# EAGLE design l293d (EAGLE 7.2.0)
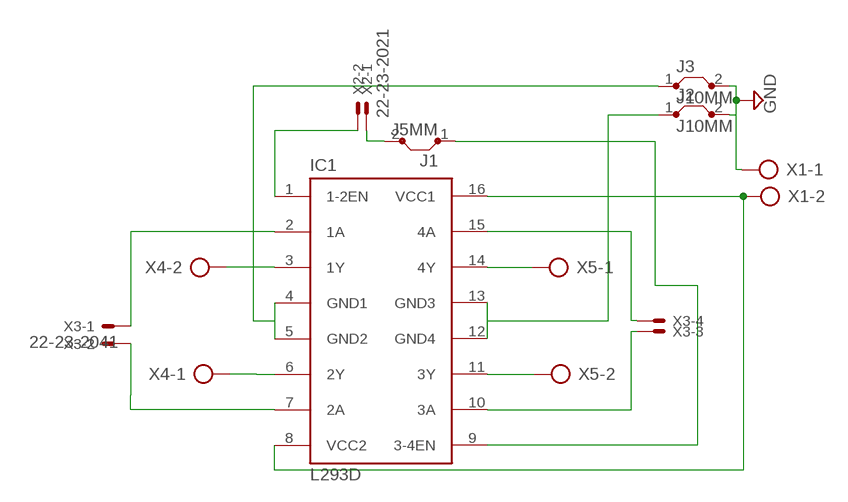
[diagram p0: schematic, sheet 1]

## Parts
IC1  L293D  [DIL16]
J1  J5MM  [05]
J2  J10MM  [10]
J3  J10MM  [10]
X1  AK500/2  [AK500/2]
X2  22-23-2021  [22-23-2021]
X3  22-23-2041  [22-23-2041]
X4  AK500/2  [AK500/2]
X5  AK500/2  [AK500/2]

## Nets
GND: J2.2 J3.2 X1.1
N$1: IC1.10(3A) X3.3
N$2: IC1.8(VCC2) IC1.16(VCC1) X1.2
N$3: IC1.2(1A) X3.1
N$4: IC1.14(4Y) X5.1
N$5: IC1.12(GND4) IC1.13(GND3) J2.1
N$6: IC1.15(4A) X3.4
N$7: IC1.1(1-2EN) X2.2
N$8: IC1.9(3-4EN) J1.1
N$9: IC1.3(1Y) X4.2
N$10: IC1.6(2Y) X4.1
N$11: IC1.11(3Y) X5.2
N$12: IC1.4(GND1) IC1.5(GND2) J3.1
N$15: J1.2 X2.1
N$16: IC1.7(2A) X3.2

## Library data of the parts
IC1 = st-microelectronics:L293D: PUSH-PULL 4 CHANNEL DRIVER; MPN: L293D; OC_FARNELL: 9589619; OC_NEWARK: 56P8249
J1-J3 = jumper:J: Bridge
X1 X4 X5 = con-ptr500:AK500/2: CONNECTOR; OC_FARNELL: unknown; OC_NEWARK: unknown
X2 = con-molex:22-23-2021: .100" (2.54mm) Center Header - 2 Pin; MF: MOLEX; MPN: 22-23-2021; OC_FARNELL: 1462926; OC_NEWARK: 25C3832
X3 = con-molex:22-23-2041: .100" (2.54mm) Center Header - 4 Pin; MF: MOLEX; MPN: 22-23-2041; OC_FARNELL: 1462920; OC_NEWARK: 38C0355

## Board
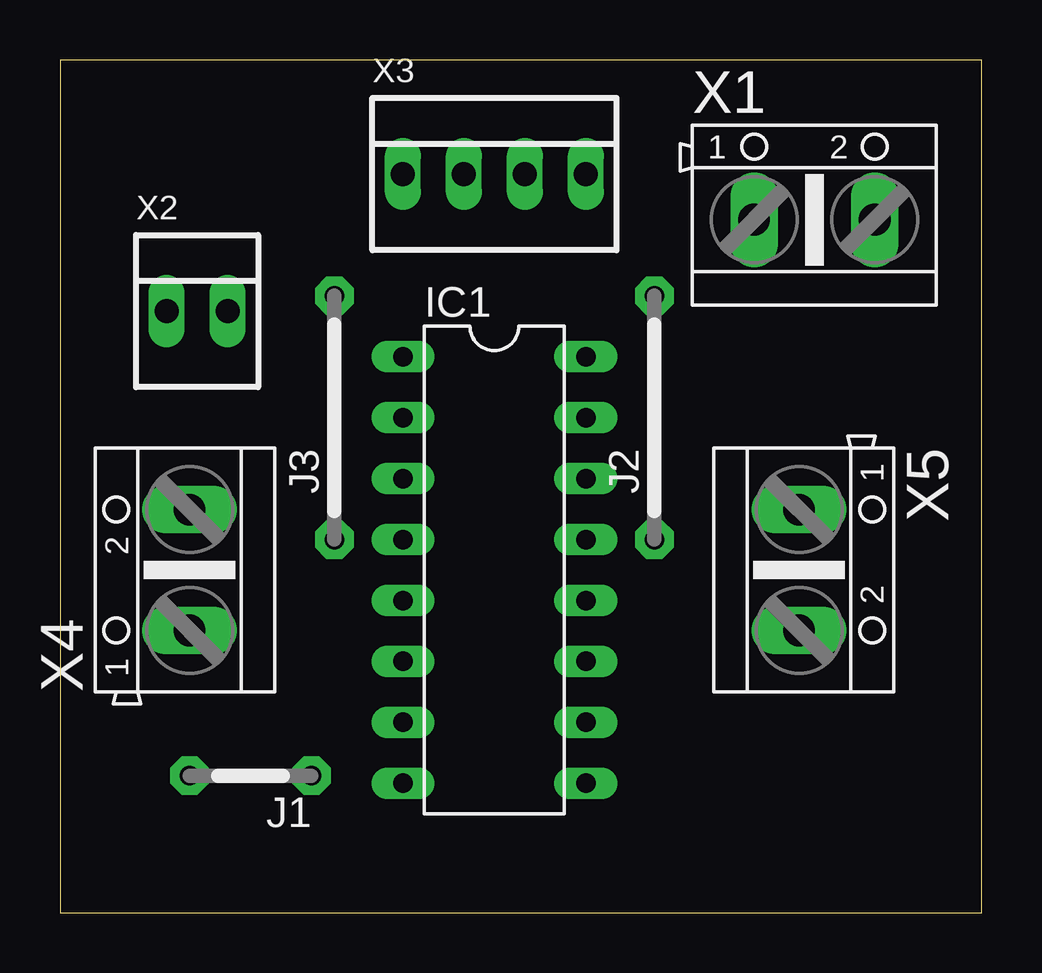
[diagram p1: board, top side]
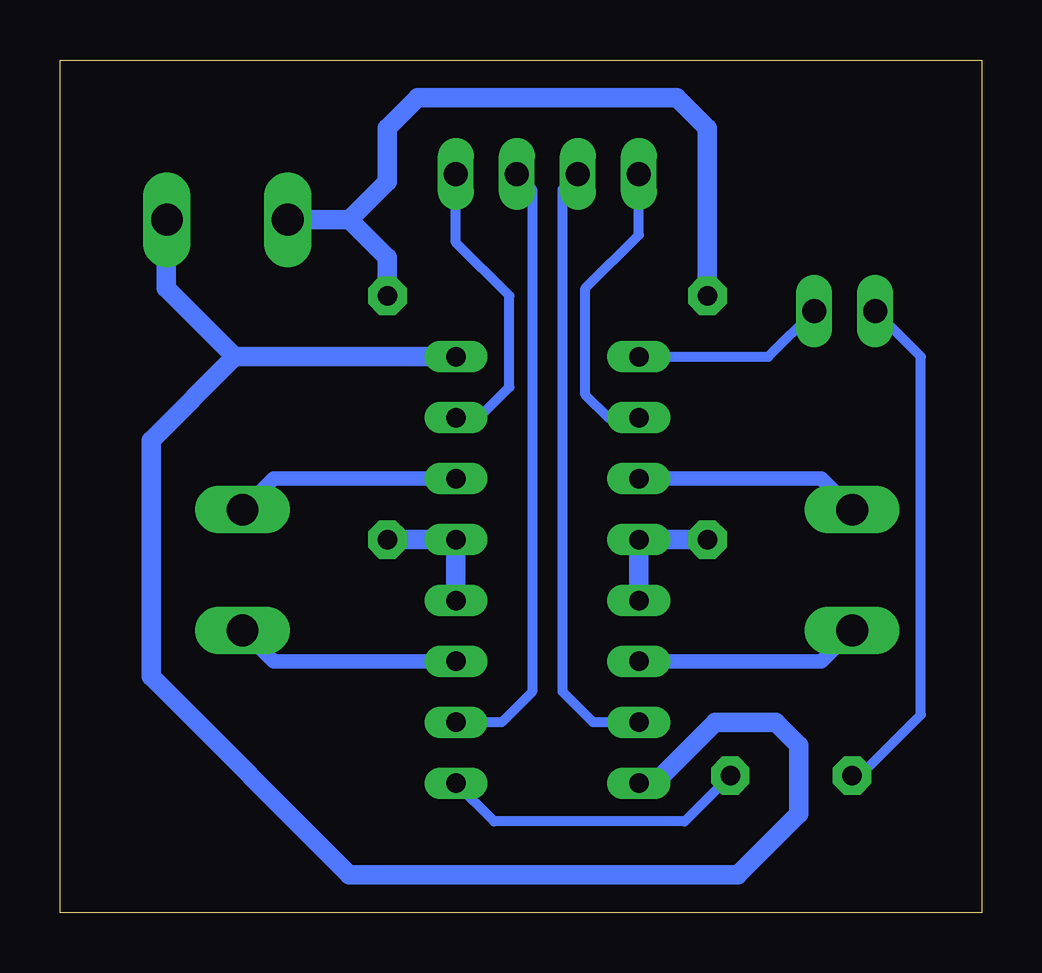
[diagram p2: board, bottom side, seen from below]

Size 38.41 x 35.55 mm. Coordinates in mm from the lower left corner, seen from the top.
Outline: 0,0 38.41,0 38.41,35.55 0,35.55 0,0
Copper layers (1*16): Top 0.035mm / dielectric 1.5mm / Bottom 0.035mm
Design rules "default": minimum track width 10mil, minimum drill 24mil, track to track 8mil, track to pad 8mil, pad to pad 8mil, via to via 8mil, smd to smd 8mil, copper to edge 40mil, drill to drill 8mil, minimum pad ring 10mil, minimum via ring 8mil, stop-mask expansion 4mil, vias tented up to drill 0mil, thermal gap 10mil

### Footprints (pad centres in the part's own frame; a part is rotated, then mirrored left to right if it is on the bottom)
DIL16 = drill 0.813 long: 1 -8.89,-3.81; 2 -6.35,-3.81; 3 -3.81,-3.81; 4 -1.27,-3.81; 5 1.27,-3.81; 6 3.81,-3.81; 7 6.35,-3.81; 8 8.89,-3.81; 9 8.89,3.81; 10 6.35,3.81; 11 3.81,3.81; 12 1.27,3.81; 13 -1.27,3.81; 14 -3.81,3.81; 15 -6.35,3.81; 16 -8.89,3.81
05 = drill 0.813 pad 1.6 octagon: 1 -2.54,0; 2 2.54,0
10 = drill 0.813 pad 1.6 octagon: 1 -5.08,0; 2 5.08,0
AK500/2 = drill 1.321 long: 1 -2.515,0; 2 2.515,0
22-23-2021 = drill 1 long: 1 -1.27,0; 2 1.27,0
22-23-2041 = drill 1 long: 1 -3.81,0; 2 -1.27,0; 3 1.27,0; 4 3.81,0

### Placement (x,y rotation side)
IC1  18.1,14.29 270 top
J1  7.94,5.71 180 top
J2  24.77,20.64 90 top
J3  11.43,20.64 90 top
X1  31.43,28.89 0 top
X2  5.71,25.08 0 top
X3  18.1,30.8 0 top
X4  5.4,14.29 90 top
X5  30.8,14.29 270 top

### Tracks (layer width: path | path; a pad name or v marks a point on that pad's centre or on a via)
GND
  Bottom 0.813: J2.2 24.77,27.3 26.35,28.89 | 26.35,28.89 X1.1 | 26.35,28.89 24.77,30.48 24.77,32.7 23.5,33.97 12.7,33.97 11.43,32.7 J3.2
N$1
  Bottom 0.406: X3.3 18.73,30.16 18.73,9.21 20,7.94 IC1.10
N$2
  Bottom 0.61: 33.97,28.87 X1.2
  Bottom 0.813: IC1.16 31.11,23.18 | 31.11,23.18 33.97,26.04 33.97,28.87 | 31.11,23.18 34.61,19.68 34.61,9.84 26.35,1.59 10.16,1.59 7.62,4.13 7.62,6.99 8.57,7.94 11.11,7.94 13.65,5.4 IC1.8
N$3
  Bottom 0.406: IC1.2 15.56,20.64 16.51,21.59 16.51,26.04 14.29,28.26 X3.1
N$4
  Bottom 0.61: IC1.14 29.5,18.1 X5.1
N$5
  Bottom 0.813: IC1.12 IC1.13 J2.1
N$6
  Bottom 0.406: IC1.15 20.95,20.64 19.68,21.91 19.68,25.72 21.91,27.94 X3.4
N$7
  Bottom 0.406: IC1.1 8.89,23.18 X2.2
N$8
  Bottom 0.406: J1.1 12.38,3.81 20.32,3.81 IC1.9
N$9
  Bottom 0.61: IC1.3 6.69,18.1 X4.2
N$10
  Bottom 0.61: IC1.6 6.69,10.48 X4.1
N$11
  Bottom 0.61: IC1.11 29.5,10.48 X5.2
N$12
  Bottom 0.813: IC1.5 IC1.4 J3.1
N$15
  Bottom 0.406: X2.1 2.54,23.18 2.54,8.26 5.08,5.71 J1.2
N$16
  Bottom 0.406: IC1.7 16.19,7.94 17.46,9.21 17.46,30.16 X3.2